# Altium schematic sheet 555流水灯.SchDoc
size A4
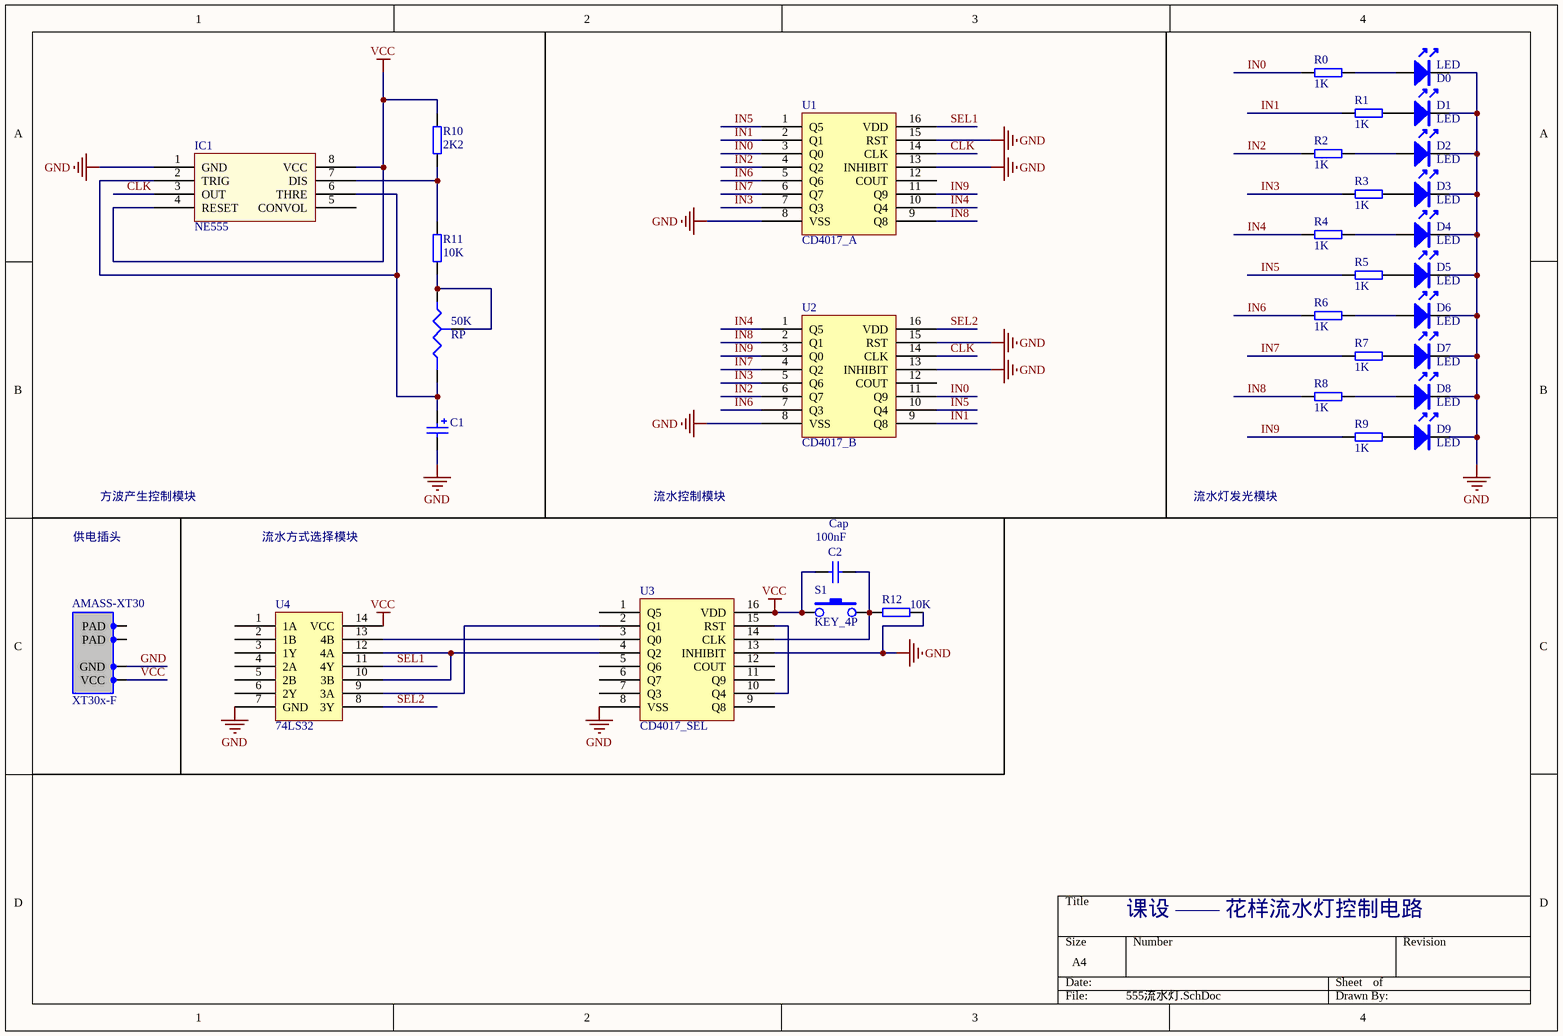
[diagram p0: 555流水灯.SchDoc]

## Parts
AMASS-XT30  XT30x-F  [XT30U-M]
C1  1uF  [RB3.5-7]  (value not drawn)
C2  Cap  value 100nF  [RAD-0.3]
D0  LED  [LED_3MM]
D1  LED  [LED_3MM]
D2  LED  [LED_3MM]
D3  LED  [LED_3MM]
D4  LED  [LED_3MM]
D5  LED  [LED_3MM]
D6  LED  [LED_3MM]
D7  LED  [LED_3MM]
D8  LED  [LED_3MM]
D9  LED  [LED_3MM]
IC1  NE555  [NE555P]
R0  1K  [AXIAL-0.4]
R1  1K  [AXIAL-0.4]
R2  1K  [AXIAL-0.4]
R3  1K  [AXIAL-0.4]
R4  1K  [AXIAL-0.4]
R5  1K  [AXIAL-0.4]
R6  1K  [AXIAL-0.4]
R7  1K  [AXIAL-0.4]
R8  1K  [AXIAL-0.4]
R9  1K  [AXIAL-0.4]
R10  2K2  [AXIAL-0.4]
R11  10K  [AXIAL-0.4]
R12  10K  [AXIAL-0.4]
RP  50K  [3296W]
S1  KEY_4P  [KEY_6*6]
U1  CD4017_A  [CD4017]
U2  CD4017_B  [CD4017]
U3  CD4017_SEL  [CD4017]
U4  74LS32  [74LS32]

## Nets
GND: AMASS-XT30.2(GND) C1.2 D0.2 D1.2 D2.2 D3.2 D4.2 D5.2 D6.2 D7.2 D8.2 D9.2 IC1.1(GND) R12.2 U1.8(VSS) U1.13(INHIBIT) U1.15(RST) U2.8(VSS) U2.13(INHIBIT) U2.15(RST) U3.8(VSS) U3.13(INHIBIT) U4.7(GND)
VCC: AMASS-XT30.1(VCC) C2.1 IC1.4(RESET) IC1.8(VCC) R10.1 S1.1 U3.16(VDD) U4.14(VCC)
CLK: IC1.3(OUT) U1.14(CLK) U2.14(CLK)
IN0: R0.1 U1.3(Q0) U2.11(Q9)
IN1: R1.1 U1.2(Q1) U2.9(Q8)
IN2: R2.1 U1.4(Q2) U2.6(Q7)
IN3: R3.1 U1.7(Q3) U2.5(Q6)
IN4: R4.1 U1.10(Q4) U2.1(Q5)
IN5: R5.1 U1.1(Q5) U2.10(Q4)
IN6: R6.1 U1.5(Q6) U2.7(Q3)
IN7: R7.1 U1.6(Q7) U2.4(Q2)
IN8: R8.1 U1.9(Q8) U2.2(Q1)
IN9: R9.1 U1.11(Q9) U2.3(Q0)
SEL1: U1.16(VDD) U4.11(4Y)
SEL2: U2.16(VDD) U4.8(3Y)
NetC1_1: C1.1 IC1.2(TRIG) IC1.6(THRE) RP.3(B)
NetC2_2: C2.2 R12.1 S1.2 U3.14(CLK)
NetD0_1: D0.1 R0.2
NetD1_1: D1.1 R1.2
NetD2_1: D2.1 R2.2
NetD3_1: D3.1 R3.2
NetD4_1: D4.1 R4.2
NetD5_1: D5.1 R5.2
NetD6_1: D6.1 R6.2
NetD7_1: D7.1 R7.2
NetD8_1: D8.1 R8.2
NetD9_1: D9.1 R9.2
NetIC1_7: IC1.7(DIS) R10.2 R11.1
NetR11_2: R11.2 RP.1(A) RP.2(TAP)
NetU3_2: U3.2(Q1) U4.9(3A)
NetU3_3: U3.3(Q0) U4.13(4B)
NetU3_4: U3.4(Q2) U4.10(3B) U4.12(4A)
NetU3_10: U3.10(Q4) U3.15(RST)

Not connected (* = marked no-connect by the designer): AMASS-XT30 0(PAD) 100(PAD); IC1 5(CONVOL); U1 12(COUT); U2 12(COUT); U3 1(Q5) 5(Q6) 6(Q7) 7(Q3) 9(Q8) 11(Q9) 12(COUT); U4 1(1A) 2(1B) 3(1Y) 4(2A) 5(2B) 6(2Y)

## Notes on the sheet
- 方波产生控制模块
- 流水控制模块
- 流水灯发光模块
- 供电插头
- 流水方式选择模块
- 课设 —— 花样流水灯控制电路

## Library data of the parts
AMASS-XT30 = XT30: Amass防打火电源接口，XT30系列
C1 = Cap Pol1: 电解电容
C2 = Cap: Capacitor; Published: 8-Jun-2000; LatestRevisionDate: 17-Jul-2002; LatestRevisionNote: Re-released for DXP Platform.; PackageReference: RAD-0.3; Publisher: Altium Limited; PackageDescription: Radial Cap, Thru-Hole; 2 Leads; 0.3 in Pin Spacing
IC1 = NE555: 时基集成
R0-R12 = RES1: 电阻
RP = Res Tap: 可调电阻; Sim Note: Enter the Resistance value and the set point into parameter fields.; Set Position: 0.5; Value: 1K; Published: 24-Mar-1999; LatestRevisionDate: 17-Jul-2002; LatestRevisionNote: Re-released for DXP Platform.; PackageReference: VR3; Publisher: Altium Limited; PackageDescription: Variable Resistor, Thru-Hole; 3 Leads
S1 = KEY_4P: 轻触按键4P
U1-U3 = CD4017